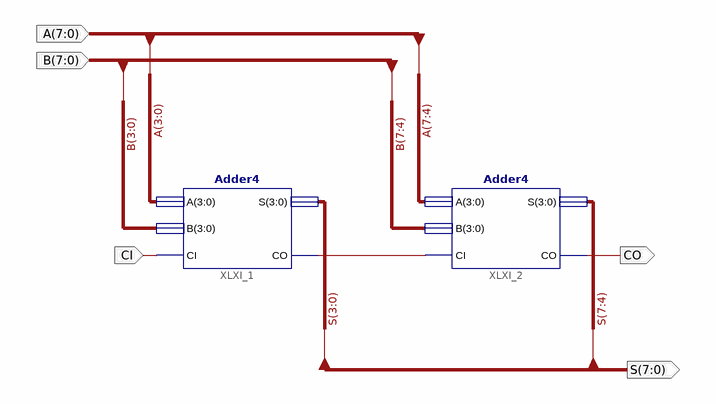
[diagram p0: schematic sheet 1]
// Xilinx ISE schematic Adder8.sch (spartan6) as structural Verilog: 2 symbols, 5 ports
module Adder8 (
  input  CI,
  input  [7:0] A,
  input  [7:0] B,
  output CO,
  output [7:0] S
);

  wire XLXN_1;

  Adder4 XLXI_1 (.CI(CI), .A(A[3:0]), .B(B[3:0]), .CO(XLXN_1), .S(S[3:0]));
  Adder4 XLXI_2 (.CI(XLXN_1), .A(A[7:4]), .B(B[7:4]), .CO(CO), .S(S[7:4]));
endmodule
